# Altium schematic sheet DC_DC_12V.SchDoc
size Tabloid; DocumentNumber: 5; SheetNumber: 5; SheetTotal: 7; Sheet_Name: 12V
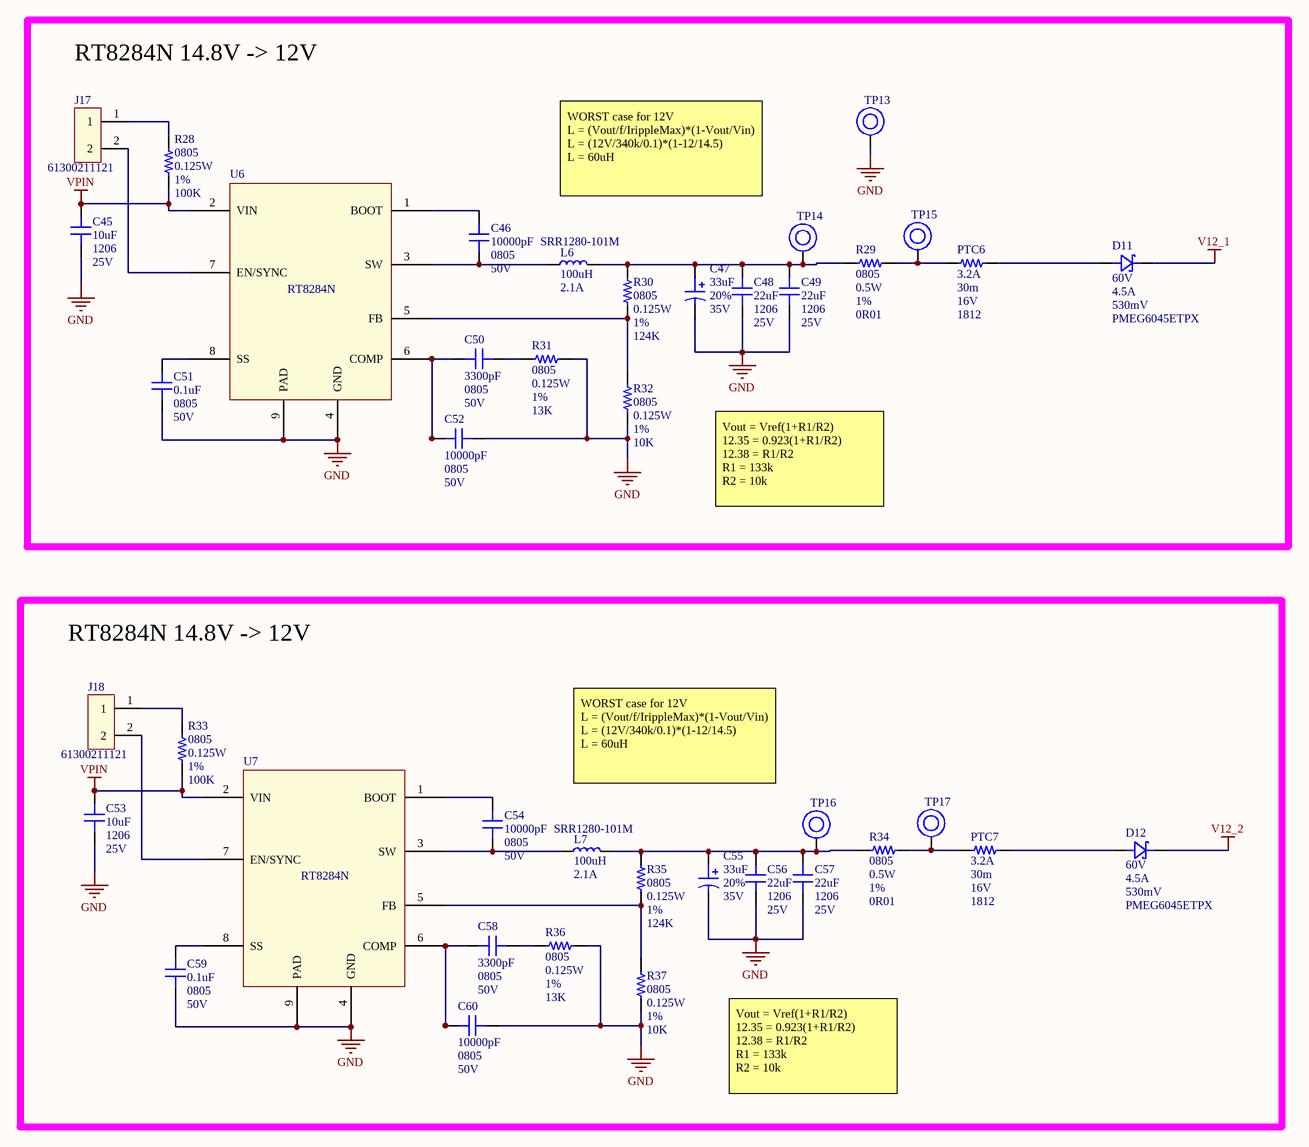
[diagram p0: DC_DC_12V.SchDoc]

## Parts
C45  value 10uF  Package: 1206  Voltage: 25V  [CAP_1206]  (hidden comment: CAP_‎CL31A106KAHNFNE‎)
C46  value 10000pF  Package: 0805  Voltage: 50V  [CAP_0805]  (hidden comment: CAP_‎‎‎‎CL21B103KBANNNC)
C47  value 33uF  Tolerance: 20%  Voltage: 35V  [CAP ALU - 6.3mm DIA]  (hidden comment: CAP_EEE-FK1V330P)
C48  value 22uF  Package: 1206  Voltage: 25V  [CAP_1206]  (hidden comment: CAP_‎‎CL31A226KAHNNNE‎)
C49  value 22uF  Package: 1206  Voltage: 25V  [CAP_1206]  (hidden comment: CAP_‎‎CL31A226KAHNNNE‎)
C50  value 3300pF  Package: 0805  Voltage: 50V  [CAP_0805]  (hidden comment: CAP_CL21B332KBANNNC‎)
C51  value 0.1uF  Package: 0805  Voltage: 50V  [CAP_0805]  (hidden comment: CAP_CC0805KRX7R9BB104‎)
C52  value 10000pF  Package: 0805  Voltage: 50V  [CAP_0805]  (hidden comment: CAP_‎‎‎‎CL21B103KBANNNC)
C53  value 10uF  Package: 1206  Voltage: 25V  [CAP_1206]  (hidden comment: CAP_‎CL31A106KAHNFNE‎)
C54  value 10000pF  Package: 0805  Voltage: 50V  [CAP_0805]  (hidden comment: CAP_‎‎‎‎CL21B103KBANNNC)
C55  value 33uF  Tolerance: 20%  Voltage: 35V  [CAP ALU - 6.3mm DIA]  (hidden comment: CAP_EEE-FK1V330P)
C56  value 22uF  Package: 1206  Voltage: 25V  [CAP_1206]  (hidden comment: CAP_‎‎CL31A226KAHNNNE‎)
C57  value 22uF  Package: 1206  Voltage: 25V  [CAP_1206]  (hidden comment: CAP_‎‎CL31A226KAHNNNE‎)
C58  value 3300pF  Package: 0805  Voltage: 50V  [CAP_0805]  (hidden comment: CAP_CL21B332KBANNNC‎)
C59  value 0.1uF  Package: 0805  Voltage: 50V  [CAP_0805]  (hidden comment: CAP_CC0805KRX7R9BB104‎)
C60  value 10000pF  Package: 0805  Voltage: 50V  [CAP_0805]  (hidden comment: CAP_‎‎‎‎CL21B103KBANNNC)
D11  Voltage: 60V  Current: 4.5A  Vf: 530mV  Part number: PMEG6045ETPX  [DO-214AC_SOD128]  (hidden comment: DIODE_SCH_PMEG6045ETPX)
D12  Voltage: 60V  Current: 4.5A  Vf: 530mV  Part number: PMEG6045ETPX  [DO-214AC_SOD128]  (hidden comment: DIODE_SCH_PMEG6045ETPX)
J17  Part number: 61300211121  [HDR1X2]  (hidden comment: Header 2 pin SM)
J18  Part number: 61300211121  [HDR1X2]  (hidden comment: Header 2 pin SM)
L6  value 100uH  Current: 2.1A  Part number: SRR1280-101M  [BOURNS 12.5x12.5mm]  (hidden comment: IND_SRR1280-101M)
L7  value 100uH  Current: 2.1A  Part number: SRR1280-101M  [BOURNS 12.5x12.5mm]  (hidden comment: IND_SRR1280-101M)
PTC6  Trip value: 3.2A  Res: 30m  Voltage: 16V  Package: 1812  [PTC - 1812]  (hidden comment: PTC_0ZCG0160BF2C)
PTC7  Trip value: 3.2A  Res: 30m  Voltage: 16V  Package: 1812  [PTC - 1812]  (hidden comment: PTC_0ZCG0160BF2C)
R28  value 100K  Package: 0805  Power: 0.125W  Tolerance: 1%  [RES_0805]  (hidden comment: RES_‎RMCF0805FT100K‎)
R29  value 0R01  Package: 0805  Power: 0.5W  Tolerance: 1%  [RES_0805]  (hidden comment: RES_‎‎‎‎‎ KRL1220E-M-R010-F-T5)
R30  value 124K  Package: 0805  Power: 0.125W  Tolerance: 1%  [RES_0805]  (hidden comment: RES_‎RMCF0805FT124K)
R31  value 13K  Package: 0805  Power: 0.125W  Tolerance: 1%  [RES_0805]  (hidden comment: RES_‎ RC0805FR-0713KL)
R32  value 10K  Package: 0805  Power: 0.125W  Tolerance: 1%  [RES_0805]  (hidden comment: RES_‎RMCF0805FT10K0)
R33  value 100K  Package: 0805  Power: 0.125W  Tolerance: 1%  [RES_0805]  (hidden comment: RES_‎RMCF0805FT100K‎)
R34  value 0R01  Package: 0805  Power: 0.5W  Tolerance: 1%  [RES_0805]  (hidden comment: RES_‎‎‎‎‎ KRL1220E-M-R010-F-T5)
R35  value 124K  Package: 0805  Power: 0.125W  Tolerance: 1%  [RES_0805]  (hidden comment: RES_‎RMCF0805FT124K)
R36  value 13K  Package: 0805  Power: 0.125W  Tolerance: 1%  [RES_0805]  (hidden comment: RES_‎ RC0805FR-0713KL)
R37  value 10K  Package: 0805  Power: 0.125W  Tolerance: 1%  [RES_0805]  (hidden comment: RES_‎RMCF0805FT10K0)
TP13  TestPoint 3x3mm  [TestPoint 3X3mm]  (value not drawn)
TP14  TestPoint 3x3mm  [TestPoint 3X3mm]  (value not drawn)
TP15  TestPoint 3x3mm  [TestPoint 3X3mm]  (value not drawn)
TP16  TestPoint 3x3mm  [TestPoint 3X3mm]  (value not drawn)
TP17  TestPoint 3x3mm  [TestPoint 3X3mm]  (value not drawn)
U6  REG_SW_RT8284N  [SOP8]  (value not drawn)
U7  REG_SW_RT8284N  [SOP8]  (value not drawn)

## Blocks framed on the sheet
RT8284N 14.8V -> 12V: C45-C52 D11 J17 L6 PTC6 R28-R32 TP13-TP15 U6
RT8284N 14.8V -> 12V: C53-C60 D12 J18 L7 PTC7 R33-R37 TP16 TP17 U7

## Nets
GND: C45.2 C47.2 C48.2 C49.2 C51.2 C52.2 C53.2 C55.2 C56.2 C57.2 C59.2 C60.2 R31.1 R32.2 R36.1 R37.2 TP13.1 U6.4(GND) U6.9(PAD) U7.4(GND) U7.9(PAD)
V12_1: D11.2
V12_2: D12.2
VPIN: C45.1 C53.1 R28.2 R33.2 U6.2(VIN) U7.2(VIN)
NetC46_1: C46.1 U6.1(BOOT)
NetC46_2: C46.2 L6.1 U6.3(SW)
NetC47_1: C47.1 C48.1 C49.1 L6.2 R29.1 R30.1 TP14.1
NetC50_1: C50.1 C52.1 U6.6(COMP)
NetC50_2: C50.2 R31.2
NetC51_1: C51.1 U6.8(SS)
NetC54_1: C54.1 U7.1(BOOT)
NetC54_2: C54.2 L7.1 U7.3(SW)
NetC55_1: C55.1 C56.1 C57.1 L7.2 R34.1 R35.1 TP16.1
NetC58_1: C58.1 C60.1 U7.6(COMP)
NetC58_2: C58.2 R36.2
NetC59_1: C59.1 U7.8(SS)
NetD11_1: D11.1 PTC6.2
NetD12_1: D12.1 PTC7.2
NetJ17_1: J17.1 R28.1
NetJ17_2: J17.2 U6.7(EN/SYNC)
NetJ18_1: J18.1 R33.1
NetJ18_2: J18.2 U7.7(EN/SYNC)
NetPTC6_1: PTC6.1 R29.2 TP15.1
NetPTC7_1: PTC7.1 R34.2 TP17.1
NetR30_2: R30.2 R32.1 U6.5(FB)
NetR35_2: R35.2 R37.1 U7.5(FB)

## Notes on the sheet
- WORST case for 12V
  L = (Vout/f/IrippleMax)*(1-Vout/Vin)
  L = (12V/340k/0.1)*(1-12/14.5)
  L = 60uH
- Vout = Vref(1+R1/R2)
  12.35 = 0.923(1+R1/R2)
  12.38 = R1/R2
  R1 = 133k
  R2 = 10k
- Sheet Name
- Project Title
- Global Project
- Size
- Group
- Revision
- Date
- Sheet
- of
- Filename
- Designers

## Library data of the parts
C45 C53 = CAP_‎CL31A106KAHNFNE‎: CAP CER 10uF 25V 1206; Part number: CL31A106KAHNFNE‎
C46 C52 C54 C60 = CAP_‎‎‎‎CL21B103KBANNNC: CAP CER 10000pF 50V 0805; Part number: ‎CL21B103KBANNNC
C47 C55 = CAP_EEE-FK1V330P: CAP ALU 33µF 35V; Part number: EEE-FK1V330P; Package: 6.30mm
C48 C49 C56 C57 = CAP_‎‎CL31A226KAHNNNE‎: CAP CER 22uF 25V 1206; Part number: CL31A226KAHNNNE‎
C50 C58 = CAP_CL21B332KBANNNC‎: CAP CER 3300pF 50V 0805; Part number: CL21B332KBANNNC‎
C51 C59 = CAP_CC0805KRX7R9BB104‎: CAP CER 0.1uF 50V 0805; Part number: CC0805KRX7R9BB104‎
D11 D12 = DIODE_SCH_PMEG6045ETPX: Diode Schottky 60V 4.5A Surface Mount CFP5; Package: SOD-128
L6 L7 = IND_SRR1280-101M: IND 100µH Shielded Wirewound Inductor 2.1A; Tolerance: 20%; Package: Nonstandard
PTC6 PTC7 = PTC_0ZCG0160BF2C: PTC_Polymeric PTC Resettable Fuse 16V 1.6A Ih; Part number: 0ZCG0160BF2C
R28 R33 = RES_‎RMCF0805FT100K‎: RES 100K 1% 1/8W 0805; Part number: ‎RMCF0805FT100K‎
R29 R34 = RES_‎‎‎‎‎ KRL1220E-M-R010-F-T5: RES 0.01R 1% 1/2W 0805; Part number: KRL1220E-M-R010-F-T5
R30 R35 = RES_‎RMCF0805FT124K: RES 124K 1% 1/8W 0805; Part number: RMCF0805FT124K
R31 R36 = RES_‎ RC0805FR-0713KL: RES 13K 1% 1/8W 0805; Part number: RC0805FR-0713KL
R32 R37 = RES_‎RMCF0805FT10K0: RES 10K 1% 1/8W 0805; Part number: RMCF0805FT10K0
U6 U7 = REG_SW_RT8284N: REG 2A, 23V, 340kHz Synchronous Step-Down Converter; Part number: RT8284N